# Altium schematic sheet BatteryBaseBoard.SchDoc
size A4
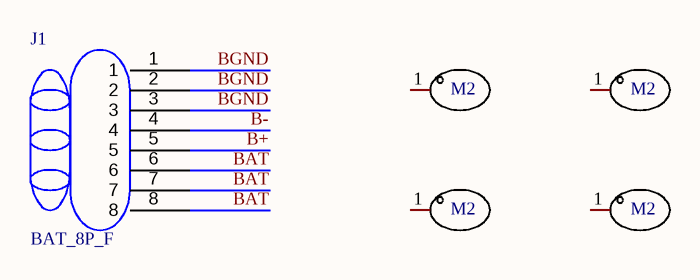
[diagram p0: BatteryBaseBoard.SchDoc]

## Parts
J1  BAT_8P_F  [BAT_8P_F]
U1  SMTSO2020CTJ  [M2*4*1.5+2.5*1]  (value not drawn)
U2  SMTSO2020CTJ  [M2*4*1.5+2.5*1]  (value not drawn)
U3  SMTSO2020CTJ  [M2*4*1.5+2.5*1]  (value not drawn)
U4  SMTSO2020CTJ  [M2*4*1.5+2.5*1]  (value not drawn)

## Nets
B+: J1.5
B-: J1.4
BAT: J1.6 J1.7 J1.8
BGND: J1.1 J1.2 J1.3

Not connected (* = marked no-connect by the designer): U1 1; U2 1; U3 1; U4 1

## Notes on the sheet
- Title
- Size:
- Date:
- A4
- Number:
- Time:
- Revision:
- Sheet
- of
- 后厂村路直博生
- File:
- (in symbol M2_NUT) M2

## Library data of the parts
U1-U4 = M2_NUT: Manufacturer: Sinhoo(雄和远景); Add into BOM: yes; Name: SMTSO2020CTJ; Symbol: SMTSO2020CTJ; Device: SMTSO2020CTJ; LCSC Part Name: 雄和远景，电路板表贴圆螺母柱，M2X2，铜镀锡; Supplier Part: C2915626; Manufacturer Part: SMTSO2020CTJ; Supplier Footprint: -; JLCPCB Part Class: Extended Part; Datasheet: https://atta.szlcsc.com/upload/public/pdf/source/20211122/17CF5E24EB4D4DC090A80DE3D7DE5E21.pdf; Supplier: LCSC; Convert to PCB: yes